# Altium schematic sheet MCU009A_Xds100v2Emu.SchDoc: Xds100v2Emu
size 431 x 279 mm; Date: Not shown in title block; ApprovedBy: Not shown in title block; CheckedBy: Not shown in title block; Author: Not shown in title block; CompanyName: Not shown in title block; Engineer: Not shown in title block; Organization: Not shown in title block; Address1: Not shown in title block; Address2: Not shown in title block; Address3: Not shown in title block; Address4: Not shown in title block; DocumentNumber: 5; Revision: Use project parameter SCH_Rev; SheetNumber: 5; SheetTotal: 7; PageSetup: Record=PageOptions|CenterHorizontal=True|CenterVertical=True|PrintScale=1.00|XCorrection=1.00|YCorrection=1.00|PrintKind=0|BorderSize=5000000|LeftOffset=0|BottomOffset=0|Orientation=2|PaperLength=1000|PaperWidth=1000|Scale=100|PaperSource=15|PrintQuality=600|MediaType=1|DitherType=10|PaperKind=Letter|PrintScaleMode=1; CurrentTime: Not shown in title block; CurrentDate: Not shown in title block; Time: Not shown in title block; DocumentFullPathAndName: Not shown in title block; DocumentName: Not shown in title block; ModifiedDate: Not shown in title block; ImagePath: Not shown in title block
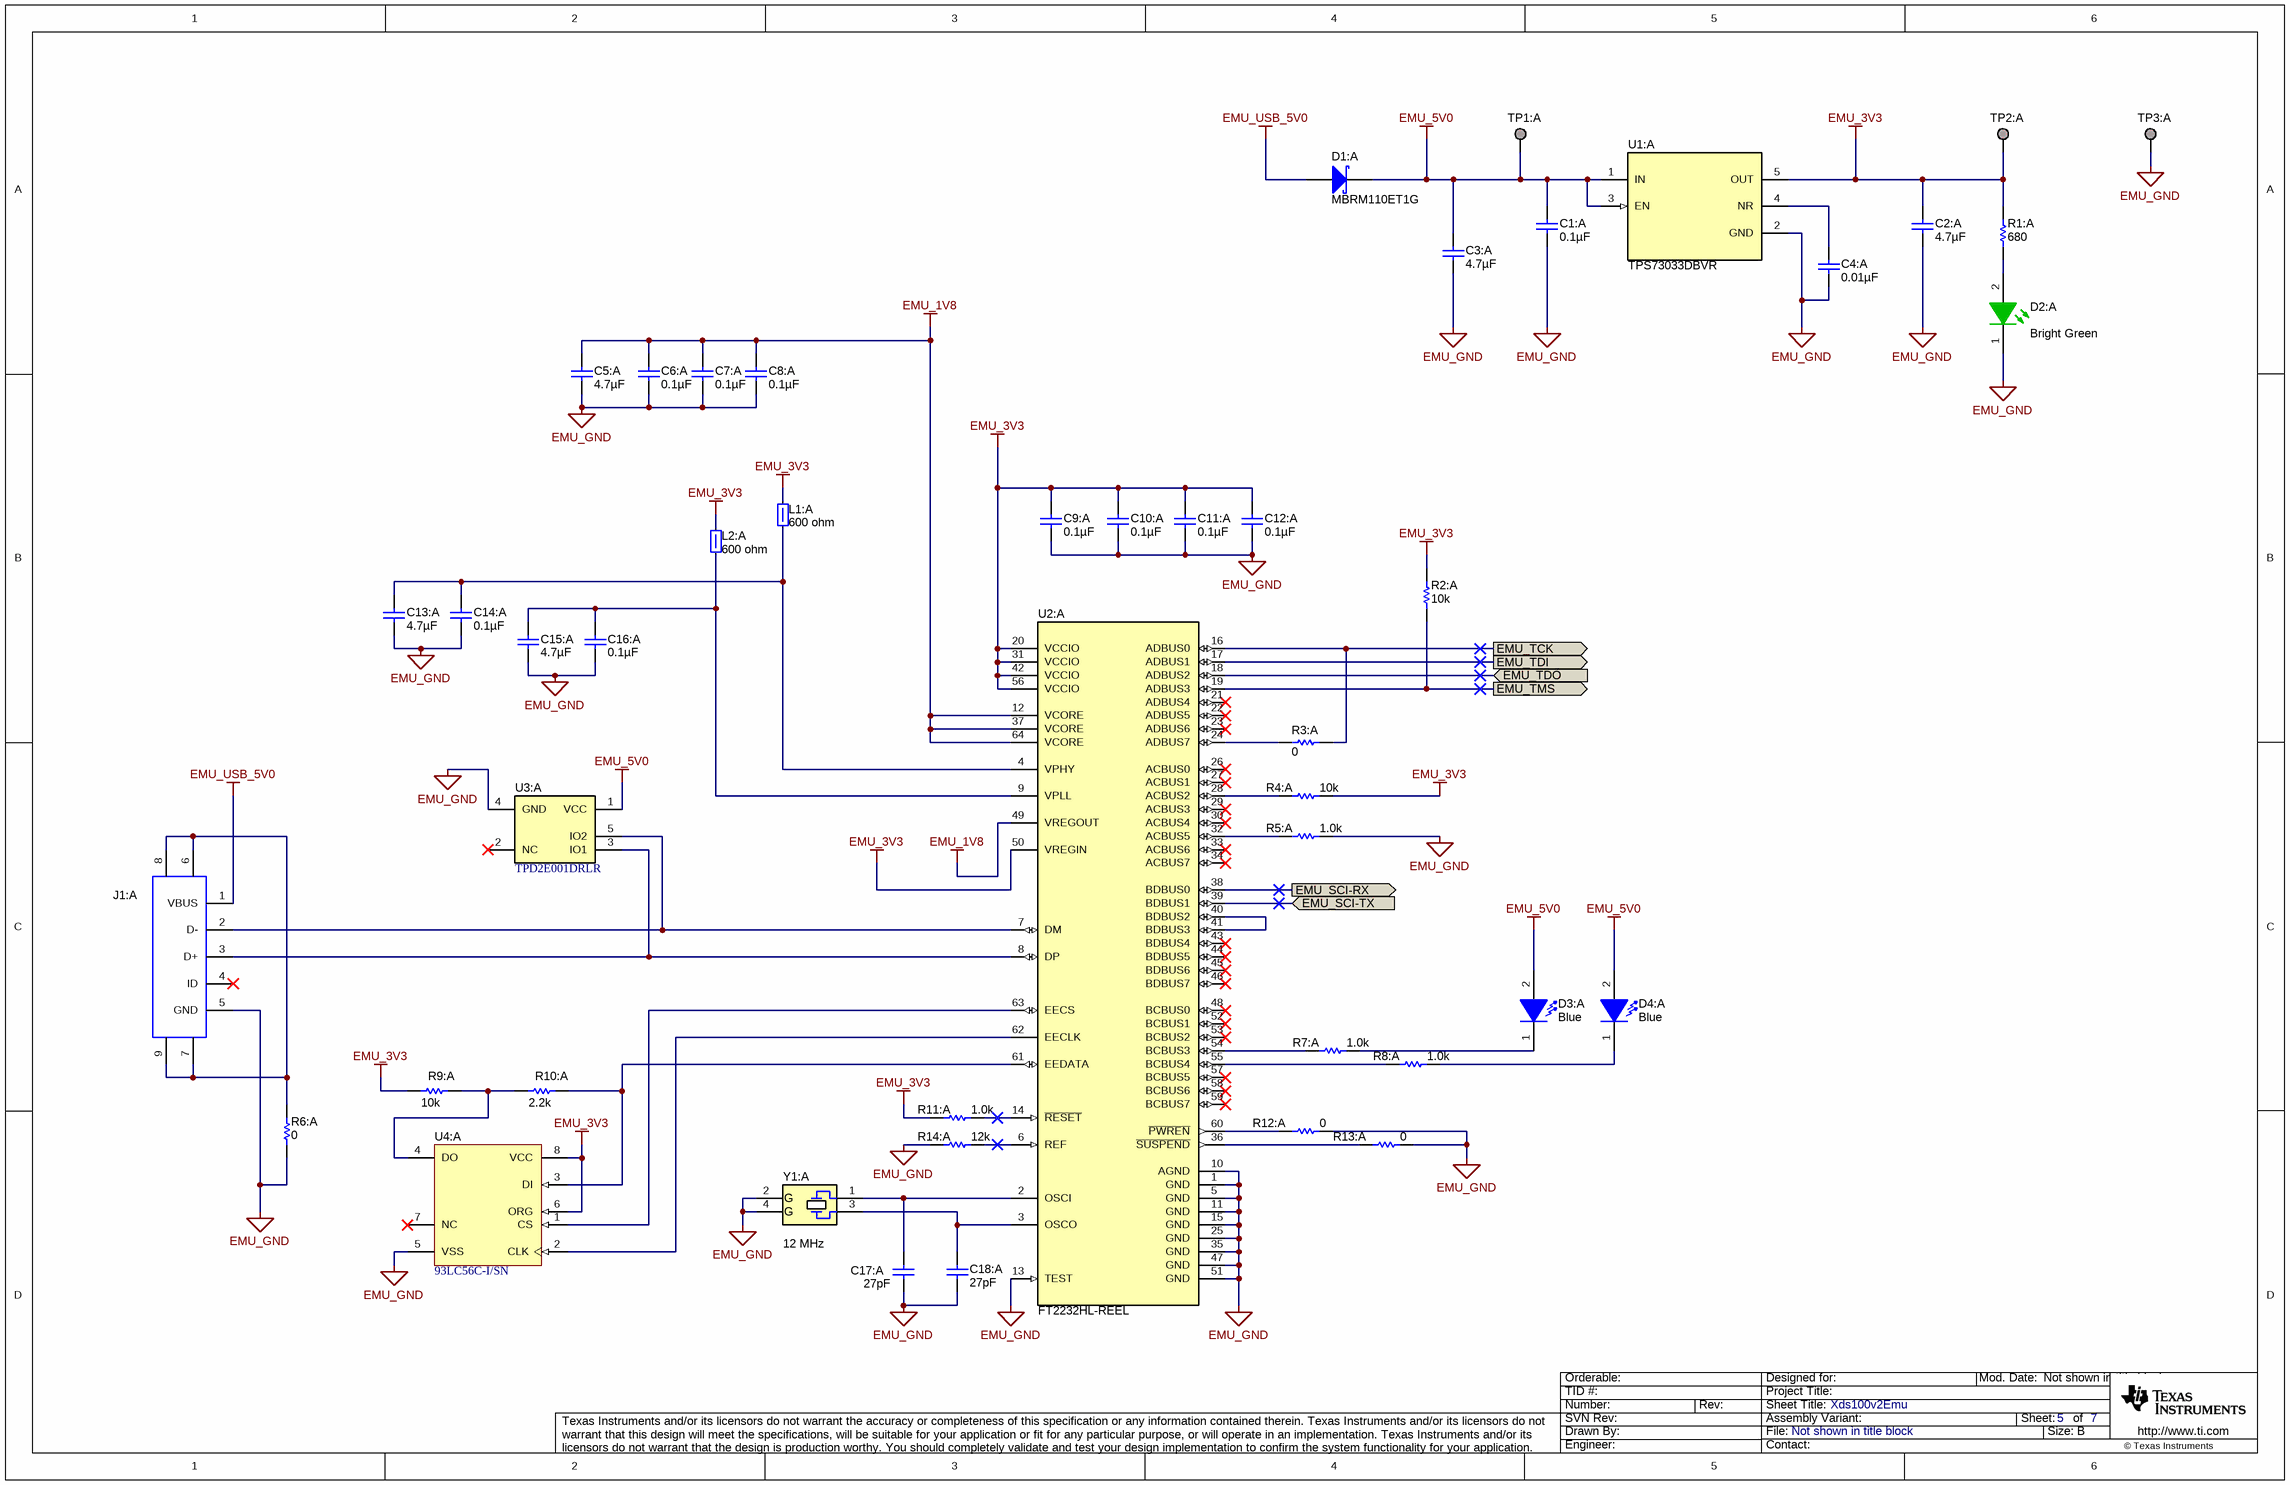
[diagram p0: MCU009A_Xds100v2Emu.SchDoc]

## Parts
C1:A  ValueDisplayed: 0.1µF  [0402]  (hidden comment: GRM155R71A104KA01D)
C2:A  ValueDisplayed: 4.7µF  [0603]  (hidden comment: GRM188R60J475ME19D)
C3:A  ValueDisplayed: 4.7µF  [0603]  (hidden comment: GRM188R60J475ME19D)
C4:A  ValueDisplayed: 0.01µF  [0402]  (hidden comment: GRM155R71C103KA01D)
C5:A  ValueDisplayed: 4.7µF  [0603]  (hidden comment: GRM188R60J475ME19D)
C6:A  ValueDisplayed: 0.1µF  [0402]  (hidden comment: GRM155R71A104KA01D)
C7:A  ValueDisplayed: 0.1µF  [0402]  (hidden comment: GRM155R71A104KA01D)
C8:A  ValueDisplayed: 0.1µF  [0402]  (hidden comment: GRM155R71A104KA01D)
C9:A  ValueDisplayed: 0.1µF  [0402]  (hidden comment: GRM155R71A104KA01D)
C10:A  ValueDisplayed: 0.1µF  [0402]  (hidden comment: GRM155R71A104KA01D)
C11:A  ValueDisplayed: 0.1µF  [0402]  (hidden comment: GRM155R71A104KA01D)
C12:A  ValueDisplayed: 0.1µF  [0402]  (hidden comment: GRM155R71A104KA01D)
C13:A  ValueDisplayed: 4.7µF  [0603]  (hidden comment: GRM188R60J475ME19D)
C14:A  ValueDisplayed: 0.1µF  [0402]  (hidden comment: GRM155R71A104KA01D)
C15:A  ValueDisplayed: 4.7µF  [0603]  (hidden comment: GRM188R60J475ME19D)
C16:A  ValueDisplayed: 0.1µF  [0402]  (hidden comment: GRM155R71A104KA01D)
C17:A  ValueDisplayed: 27pF  [0402]  (hidden comment: GRM1555C1H270JA01D)
C18:A  ValueDisplayed: 27pF  [0402]  (hidden comment: GRM1555C1H270JA01D)
D1:A  MBRM110ET1G  [POWERMITE]
D2:A  value Bright Green  [WL-SMCW_Green_0805]  (hidden comment: 150080VS75000)
D3:A  value Blue  [WL-SMCW_Blue_0805]  (hidden comment: 150080BS75000)
D4:A  value Blue  [WL-SMCW_Blue_0805]  (hidden comment: 150080BS75000)
J1:A  65100516121  [Wurth_65100516121]  (value not drawn)
L1:A  value 600 ohm  [0805_HV]  (hidden comment: HZ0805E601R-10)
L2:A  value 600 ohm  [0805_HV]  (hidden comment: HZ0805E601R-10)
R1:A  ValueDisplayed: 680  [0402]  (hidden comment: CRCW0402680RJNED)
R2:A  ValueDisplayed: 10k  [0402]  (hidden comment: CRCW040210K0JNED)
R3:A  ValueDisplayed: 0  [0402]  (hidden comment: CRCW04020000Z0ED)
R4:A  ValueDisplayed: 10k  [0402]  (hidden comment: CRCW040210K0JNED)
R5:A  ValueDisplayed: 1.0k  [0402]  (hidden comment: CRCW04021K00JNED)
R6:A  ValueDisplayed: 0  [0402]  (hidden comment: CRCW04020000Z0ED)
R7:A  ValueDisplayed: 1.0k  [0402]  (hidden comment: CRCW04021K00JNED)
R8:A  ValueDisplayed: 1.0k  [0402]  (hidden comment: CRCW04021K00JNED)
R9:A  ValueDisplayed: 10k  [0402]  (hidden comment: CRCW040210K0JNED)
R10:A  ValueDisplayed: 2.2k  [0402]  (hidden comment: CRCW04022K20JNED)
R11:A  ValueDisplayed: 1.0k  [0402]  (hidden comment: CRCW04021K00JNED)
R12:A  ValueDisplayed: 0  [0402]  (hidden comment: CRCW04020000Z0ED)
R13:A  ValueDisplayed: 0  [0402]  (hidden comment: CRCW04020000Z0ED)
R14:A  ValueDisplayed: 12k  [0402]  (hidden comment: CRCW040212K0JNED)
TP1:A  TESTPOINT  [TP_50MIL-25MILHOLE]  (value not drawn)  (no BOM)
TP2:A  TESTPOINT  [TP_50MIL-25MILHOLE]  (value not drawn)  (no BOM)
TP3:A  TESTPOINT  [TP_50MIL-25MILHOLE]  (value not drawn)  (no BOM)
U1:A  TPS73033DBVR  [DBV0005A_N]
U2:A  FT2232HL-REEL  [LQFP64_N]
U3:A  TPD2E001DRLR  [DRL0005A]
U4:A  93LC56C-I/SN  [SOIC-8]
Y1:A  Frequency: 12 MHz  [ECS_ECX-53B]  (hidden comment: ECS-120-20-30B-TR)

## Ports
EMU_SCI-RX (out), EMU_SCI-TX (in), EMU_TCK (out), EMU_TDI (out), EMU_TDO (in), EMU_TMS (out)

## Nets
EMU_1V8: C5:A.2 C6:A.2 C7:A.2 C8:A.2 U2:A.12(VCORE) U2:A.37(VCORE) U2:A.49(VREGOUT) U2:A.64(VCORE)
EMU_3V3: C2:A.1 C9:A.2 C10:A.2 C11:A.2 C12:A.2 L1:A.2 L2:A.2 R1:A.1 R2:A.2 R4:A.2 R9:A.1 R11:A.1 TP2:A.1 U1:A.5(OUT) U2:A.20(VCCIO) U2:A.31(VCCIO) U2:A.42(VCCIO) U2:A.50(VREGIN) U2:A.56(VCCIO) U4:A.6(ORG) U4:A.8(VCC)
EMU_5V0: C1:A.2 C3:A.1 D1:A.1(K) D3:A.2(A) D4:A.2(A) TP1:A.1 U1:A.1(IN) U1:A.3(EN) U3:A.1(VCC)
EMU_GND: C1:A.1 C2:A.2 C3:A.2 C4:A.1 C5:A.1 C6:A.1 C7:A.1 C8:A.1 C9:A.1 C10:A.1 C11:A.1 C12:A.1 C13:A.2 C14:A.1 C15:A.2 C16:A.1 C17:A.1 C18:A.1 D2:A.1(K) J1:A.5(GND) R5:A.2 R6:A.2 R12:A.1 R13:A.1 R14:A.1 TP3:A.1 U1:A.2(GND) U2:A.1(GND) U2:A.5(GND) U2:A.10(AGND) U2:A.11(GND) U2:A.13(TEST) U2:A.15(GND) U2:A.25(GND) U2:A.35(GND) U2:A.47(GND) U2:A.51(GND) U3:A.4(GND) U4:A.5(VSS) Y1:A.2(GND) Y1:A.4(GND)
EMU_USB_5V0: D1:A.2(A) J1:A.1(VBUS)
EMU_SCI-RX: U2:A.38(BDBUS0) ; port EMU_SCI-RX
EMU_SCI-TX: U2:A.39(BDBUS1) ; port EMU_SCI-TX
EMU_TCK: R3:A.1 U2:A.16(ADBUS0) ; port EMU_TCK
EMU_TDI: U2:A.17(ADBUS1) ; port EMU_TDI
EMU_TDO: U2:A.18(ADBUS2) ; port EMU_TDO
EMU_TMS: R2:A.1 U2:A.19(ADBUS3) ; port EMU_TMS
NetC4:A_2: C4:A.2 U1:A.4(NR)
NetC13:A_1: C13:A.1 C14:A.2 L1:A.1 U2:A.4(VPHY)
NetC15:A_1: C15:A.1 C16:A.2 L2:A.1 U2:A.9(VPLL)
NetC17:A_2: C17:A.2 U2:A.2(OSCI) Y1:A.1
NetC18:A_2: C18:A.2 U2:A.3(OSCO) Y1:A.3
NetD2:A_2: D2:A.2(A) R1:A.2
NetD3:A_1: D3:A.1(K) R7:A.2
NetD4:A_1: D4:A.1(K) R8:A.2
NetJ1:A_2: J1:A.2(D-) U2:A.7(DM) U3:A.5(IO2)
NetJ1:A_3: J1:A.3(D+) U2:A.8(DP) U3:A.3(IO1)
NetJ1:A_6: J1:A.6 J1:A.7 J1:A.8 J1:A.9 R6:A.1
NetR3:A_2: R3:A.2 U2:A.24(ADBUS7)
NetR4:A_1: R4:A.1 U2:A.28(ACBUS2)
NetR5:A_1: R5:A.1 U2:A.32(ACBUS5)
NetR7:A_1: R7:A.1 U2:A.54(BCBUS3)
NetR8:A_1: R8:A.1 U2:A.55(BCBUS4)
NetR9:A_2: R9:A.2 R10:A.1 U4:A.4(DO)
NetR10:A_2: R10:A.2 U2:A.61(EEDATA) U4:A.3(DI)
NetR11:A_2: R11:A.2 U2:A.14(~{RESET})
NetR12:A_2: R12:A.2 U2:A.60(~{PWREN})
NetR13:A_2: R13:A.2 U2:A.36(~{SUSPEND})
NetR14:A_2: R14:A.2 U2:A.6(REF)
NetU2:A_40: U2:A.40(BDBUS2) U2:A.41(BDBUS3)
NetU2:A_62: U2:A.62(EECLK) U4:A.2(CLK)
NetU2:A_63: U2:A.63(EECS) U4:A.1(CS)

Not connected (* = marked no-connect by the designer): J1:A 4(ID)*; U2:A 21(ADBUS4)* 22(ADBUS5)* 23(ADBUS6)* 26(ACBUS0)* 27(ACBUS1)* 29(ACBUS3)* 30(ACBUS4)* 33(ACBUS6)* 34(ACBUS7)* 43(BDBUS4)* 44(BDBUS5)* 45(BDBUS6)* 46(BDBUS7)* 48(BCBUS0)* 52(BCBUS1)* 53(BCBUS2)* 57(BCBUS5)* 58(BCBUS6)* 59(BCBUS7)*; U3:A 2(NC)*; U4:A 7(NC)*

## Notes on the sheet
- Drawn By:
- SVN Rev:
- Number:
- TID #:
- Orderable:
- Rev:
- Sheet Title:
- File:
- Project Title:
- Designed for:
- Assembly Variant:
- Mod. Date:
- Sheet:
- Size:
- of
- B
- http://www.ti.com
- Texas Instruments and/or its licensors do not warrant the accuracy or completeness of this specification or any information contained therein. Texas Instruments and/or its licensors do not warrant that this design will meet the specifications, will be suitable for your application or fit for any particular purpose, or will operate in an implementation. Texas Instruments and/or its licensors do not warrant that the design is production worthy. You should completely validate and test your design implementation to confirm the system functionality for your application.
- Engineer:
- Contact:
- © Texas Instruments
- (in symbol ECS-120-20-30B-TR) G

## Library data of the parts
C1:A C6:A C7:A C8:A C9:A C10:A C11:A C12:A C14:A C16:A = GRM155R71A104KA01D: CAP, CERM, 0.1 µF, 10 V, +/- 10%, X7R, 0402; Manufacturer: MuRata; Polarized: N; CompType: Capacitor; Value: 0.1uF; U/M: EA; Cap_F: 0.0000001; Tolerance_%: 10; Value1: Unknown; Value2: 10V; TaMin_C: -55; TaMax_C: 125; AEC Category: Q200; SizeArea_mm2: 0.5; SizeAreaWB_mm2: 3; SizeX_mm: 1; SizeZ_mm: 0.6; SymbolVersion: 2008-07-09; PartNumber: GRM155R71A104KA01D; PackageReference: 0402; RoHS: Y; VDC_V: 10; MountType: SMT; Technology: Ceramic; TempCo: X7R; Cap_Case: 0402; Published: 2008-06-19; Publisher: Texas Instruments; LatestRevisionDate: 2016-10-03; ComponentLink1Description: Datasheet link; ComponentLink1URL: http://search.murata.co.jp/Ceramy/PnsearchViewAction.do?HnOFG=ON&HnNFG=ON&SEL_CNT=50&sLang=en&sKey=GRM155R71A104KA01D&x=9&y=9&search=startwith; Supplier 1: Digi-Key; Supplier Part Number 1: GRM155R71A104KA01D-ND; Supplier 2: Mouser; Supplier Part Number 2: 81-GRM155R71A104KA1D; Supplier 3: Farnell; Supplier Part Number 3: 1828860; AEC Qualified: ?; SizeY_mm: 0.5
C2:A C3:A C5:A C13:A C15:A = GRM188R60J475ME19D: CAP, CERM, 4.7 µF, 6.3 V, +/- 20%, X5R, 0603; Manufacturer: MuRata; Polarized: N; CompType: Capacitor; Value: 4.7uF; U/M: EA; Cap_F: 0.0000047; Tolerance_%: 20; ESR_ohm: 0.001; Value1: 0.001 ohm; VDC_V: 6.3; Value2: 6.3V; TaMin_C: -55; TaMax_C: 85; AEC Category: Q200; SizeArea_mm2: 1.28; SizeAreaWB_mm2: 4.68; SizeX_mm: 1.6; SizeY_mm: 0.8; SizeZ_mm: 1; SymbolVersion: 2008-07-09; PartNumber: GRM188R60J475ME19D; PackageReference: 0603; RoHS: Y; MountType: SMT; Technology: Ceramic; TempCo: X5R; Cap_Case: 0603; Published: 2008-06-19; Publisher: Texas Instruments; LatestRevisionDate: 2016-10-03; ComponentLink1Description: Datasheet link; ComponentLink1URL: http://search.murata.co.jp/Ceramy/image/img/PDF/ENG/GRM188R60J475ME19.pdf; Supplier 1: Digi-Key; Supplier Part Number 1: 490-5421-1-ND; Supplier 2: Mouser; Supplier Part Number 2: 81-GRM188R60J475ME9D; AEC Qualified: ?
C4:A = GRM155R71C103KA01D: CAP, CERM, 0.01 µF, 16 V, +/- 10%, X7R, 0402; Manufacturer: MuRata; Polarized: N; CompType: Capacitor; Value: 0.01uF; U/M: EA; Cap_F: 0.00000001; Tolerance_%: 10; Value1: Unknown; VDC_V: 16; Value2: 16V; TaMin_C: -55; TaMax_C: 125; AEC Category: Q200; SizeArea_mm2: 0.5; SizeAreaWB_mm2: 3; SizeX_mm: 1; SizeZ_mm: 0.6; SymbolVersion: 2008-07-09; PartNumber: GRM155R71C103KA01D; PackageReference: 0402; RoHS: Y; MountType: SMT; Technology: Ceramic; TempCo: X7R; Cap_Case: 0402; Published: 2008-06-19; Publisher: Texas Instruments; LatestRevisionDate: 2016-10-03; ComponentLink1Description: Datasheet link; ComponentLink1URL: http://search.murata.co.jp/Ceramy/PnsearchViewAction.do?HnOFG=ON&HnNFG=ON&SEL_CNT=50&sLang=en&sKey=GRM155R71C103KA01D&x=9&y=9&search=startwith; Supplier 1: Digi-Key; Supplier Part Number 1: 490-1313-1-ND; Supplier 2: Mouser; Supplier Part Number 2: 81-GRM36X103K16; Supplier 3: Farnell; Supplier Part Number 3: 1828864; AEC Qualified: ?; SizeY_mm: 0.5
C17:A C18:A = GRM1555C1H270JA01D: CAP, CERM, 27 pF, 50 V, +/- 5%, C0G/NP0, 0402; Manufacturer: MuRata; Polarized: N; CompType: Capacitor; Value: 27pF; U/M: EA; Cap_F: 0.000000000027; Tolerance_%: 5; Value1: Unknown; VDC_V: 50; Value2: 50V; TaMin_C: -55; TaMax_C: 125; AEC Category: Q200; SizeArea_mm2: 0.5; SizeAreaWB_mm2: 3; SizeX_mm: 1; SizeZ_mm: 0.6; SymbolVersion: 2008-07-09; PartNumber: GRM1555C1H270JA01D; PackageReference: 0402; RoHS: Y; MountType: SMT; Technology: Ceramic; TempCo: C0G/NP0; Cap_Case: 0402; Published: 2008-06-19; Publisher: Texas Instruments; LatestRevisionDate: 2016-10-03; ComponentLink1Description: Datasheet link; ComponentLink1URL: http://search.murata.co.jp/Ceramy/PnsearchViewAction.do?HnOFG=ON&HnNFG=ON&SEL_CNT=50&sLang=en&sKey=GRM1555C1H270JA01D&x=9&y=9&search=startwith; Supplier 1: Mouser; Supplier Part Number 1: 81-GRM1555C1H270JA1D; Supplier 2: Farnell; Supplier Part Number 2: 1828877; Supplier 3: Newark; Supplier Part Number 3: 14T3294; AEC Qualified: ?; SizeY_mm: 0.5
D1:A = MBRM110ET1G: Diode, Schottky, 10 V, 1 A, AEC-Q101, POWERMITE; Manufacturer: ON Semiconductor; U/M: EA; Vf_V: 0.53; Value: 10V; Value1: 1A; Value2: 0.53V; Io_A: 1; Vr_V: 10; TJmax_C: 150; AEC Category: Q101; AEC Qualified: Y; SizeAreaWB_mm2: 14.945; SizeArea_mm2: 7.995; SizeX_mm: 3.9; SizeY_mm: 2.05; SizeZ_mm: 1.15; CompType: Diode; SymbolVersion: 2008-12-08; PartNumber: MBRM110ET1G; PackageReference: POWERMITE; MountType: SMT; Type: Schottky; RoHS: Y; Published: 2008-06-26; Publisher: Texas Instruments; LatestRevisionDate: 2016-09-30; ComponentLink1Description: Datasheet link; ComponentLink1URL: http://www.onsemi.com/pub_link/Collateral/MBRM110E-D.PDF; Supplier 1: Digi-Key; Supplier Part Number 1: MBRM110ET1GOSCT-ND; Supplier 2: Mouser; Supplier Part Number 2: 863-MBRM110ET1G; Supplier 3: Farnell; Supplier Part Number 3: 2369429
D2:A = 150080VS75000: LED, Bright Green, SMD; Manufacturer: Wurth Elektronik; SymbolCreator: Altium; Type: AlInGaP; Vf_V: 2; Value2: 2V; Io_A: 0.02; Vr_V: 5; Tjmax_C: 85; Power_TotalModule: 0.072; Value1: 0.072W; Angle: 140; U/M: EA; SymbolVersion: 2015-01-20; PartNumber: 150080VS75000; PackageReference: LED_0805; RoHS: Y; CompType: LED; MountType: SMT; Color: Bright Green; Published: 2008-07-11; Publisher: Texas Instruments; ComponentLink1URL: http://katalog.we-online.de/led/datasheet/150080VS75000.pdf; ComponentLink1Description: Datasheet link; LatestRevisionDate: 2016-09-30; Supplier 1: Digi-Key; Supplier Part Number 1: 732-4986-1-ND; Supplier 2: Mouser; Supplier Part Number 2: 710-150080VS75000; Supplier 3: Farnell; Supplier Part Number 3: 2322081
D3:A D4:A = 150080BS75000: LED, Blue, SMD; Manufacturer: Wurth Elektronik; Type: InGaN; Vf_V: 3.2; Value2: 3.2V; Io_A: 0.02; Vr_V: 5; Tjmax_C: 85; Power_TotalModule: 0.105; Value1: 0.105W; Angle: 140; U/M: EA; CompType: LED; PartNumber: 150080BS75000; SymbolVersion: 2008-11-06; MountType: SMT; RoHS: Y; PackageReference: LED_0805; Color: Blue; Published: 2008-07-11; Publisher: Texas Instruments; ComponentLink1URL: http://katalog.we-online.de/led/datasheet/150080BS75000.pdf; ComponentLink1Description: Datasheet link; LatestRevisionDate: 2016-09-30; Supplier 1: Digi-Key; Supplier Part Number 1: 732-4982-1-ND; Supplier 2: Mouser; Supplier Part Number 2: 710-150080BS75000; Supplier 3: Farnell; Supplier Part Number 3: 2322075
J1:A = 65100516121: Connector, Receptacle, USB Mini B 2.0, SMT; Manufacturer: Wurth Elektronik; SymbolCreator: a0799628; Pitch_mm: 0.8; Gender: Female; Row_Count: 1; ContactFinish: Gold; Voltage_V: 30; Cert_UL: Y; SymbolVersion: 2013-05-02; PartNumber: 65100516121; PackageReference: Connector, Receptacle, USB Mini B 2.0, 5 Position, SMT; CompType: Connector; RoHS: Y; MountType: SMT; ComponentLink1Description: Datasheet URL; ComponentLink1URL: http://katalog.we-online.de/em/datasheet/65100516121.pdf; Publisher: Texas Instruments; LatestRevisionDate: 2016-10-04; Supplier 1: Digi-Key; Supplier Part Number 1: 732-2109-1-ND; Supplier 2: Mouser; Supplier Part Number 2: 710-65100516121; Supplier 3: Farnell; Supplier Part Number 3: 1642036; Orientation: R/A; PinCount: 5; Color: Black; Current_A: 1; Cert_CULUS: Y
L1:A L2:A = HZ0805E601R-10: Ferrite Bead, 600 ohm @ 100 MHz, 0.5 A, 0805; Manufacturer: Laird-Signal Integrity Products; Imax_A: 0.5; DCR_ohm: 0.3; Value1: 0.3 ohm; Value2: 0.5A; ZTyp@100MHz_Ohm: 600; CompType: Ferrite Bead; SymbolVersion: 2009-06-02; PartNumber: HZ0805E601R-10; MountType: SMT; PackageReference: 0805; Published: 2014-04-30; Publisher: Texas Instruments; LatestRevisionDate: 2016-10-02; ComponentLink1Description: Datasheet link; ComponentLink1URL: http://www.lairdtech.com/WorkArea/linkit.aspx?linkIdentifier=id&ItemID=4884; RoHS: Y; Supplier 1: Digi-Key; Supplier Part Number 1: 240-2399-1-ND; Supplier 2: Mouser; Supplier Part Number 2: 875-HZ0805E601R-10; Supplier 3: Farnell; Supplier Part Number 3: 2292412
R1:A = CRCW0402680RJNED: RES, 680, 5%, 0.063 W, 0402; Manufacturer: Vishay-Dale; CompType: Resistor; Value: 680; Value_Code: 680R; Tolerance_%: 5; Power_W: 0.063; Value2: 0.063W; VDC_V: 50; TempCo: 200 ppm/C; EIA_Code: E24; U/M: EA; AEC Category: Q200; SizeArea_mm2: 0.5; SizeX_mm: 1; SizeZ_mm: 0.6; SymbolVersion: 2009-05-29; PartNumber: CRCW0402680RJNED; PackageReference: 0402; RoHS: Y; Res_ohm: 680; Value1: 5%; MountType: SMT; Technology: Thick Film; Published: 2008-06-26; Publisher: Texas Instruments; LatestRevisionDate: 2016-10-03; ComponentLink1Description: Datasheet link; ComponentLink1URL: http://www.vishay.com/docs/20035/dcrcwe3.pdf; Supplier 1: Digi-Key; Supplier Part Number 1: 541-680JCT-ND; Supplier 2: Mouser; Supplier Part Number 2: 71-CRCW0402J-680-E3; Supplier 3: Farnell; Supplier Part Number 3: 1537434; AEC Qualified: ?; SizeY_mm: 0.5
R2:A R4:A R9:A = CRCW040210K0JNED: RES, 10 k, 5%, 0.063 W, 0402; Manufacturer: Vishay-Dale; CompType: Resistor; Value: 10k; Res_ohm: 10000; Value_Code: 10k0; Tolerance_%: 5; Power_W: 0.063; Value2: 0.063W; VDC_V: 50; TempCo: 200 ppm/C; EIA_Code: E24; U/M: EA; AEC Category: Q200; SizeArea_mm2: 0.5; SizeX_mm: 1; SizeZ_mm: 0.6; SymbolVersion: 2009-05-29; PartNumber: CRCW040210K0JNED; PackageReference: 0402; RoHS: Y; Value1: 5%; MountType: SMT; Technology: Thick Film; Published: 2008-06-26; Publisher: Texas Instruments; LatestRevisionDate: 2016-10-03; ComponentLink1Description: Datasheet link; ComponentLink1URL: http://www.vishay.com/docs/20035/dcrcwe3.pdf; Supplier 1: Digi-Key; Supplier Part Number 1: 541-10KJCT-ND; Supplier 2: Mouser; Supplier Part Number 2: 71-CRCW0402J-10K-E3; Supplier 3: Farnell; Supplier Part Number 3: 1514663; AEC Qualified: ?; SizeY_mm: 0.5
R3:A R6:A R12:A R13:A = CRCW04020000Z0ED: RES, 0, 5%, 0.063 W, 0402; Manufacturer: Vishay-Dale; CompType: Resistor; Value: 0; Value_Code: 0000; Tolerance_%: 5; Power_W: 0.063; Value2: 0.063W; VDC_V: 50; TempCo: 200 ppm/C; EIA_Code: E24; U/M: EA; AEC Category: Q200; SizeArea_mm2: 0.5; SizeX_mm: 1; SizeZ_mm: 0.6; SymbolVersion: 2009-05-29; PartNumber: CRCW04020000Z0ED; PackageReference: 0402; RoHS: Y; Res_ohm: 0; Value1: 5%; MountType: SMT; Technology: Thick Film; Published: 2008-06-26; Publisher: Texas Instruments; LatestRevisionDate: 2016-10-03; ComponentLink1Description: Datasheet link; ComponentLink1URL: http://www.vishay.com/docs/20035/dcrcwe3.pdf; Supplier 1: Digi-Key; Supplier Part Number 1: 541-0.0JCT-ND; Supplier 2: Mouser; Supplier Part Number 2: 71-CRCW0402-0-E3; Supplier 3: Farnell; Supplier Part Number 3: 1469661; AEC Qualified: ?; SizeY_mm: 0.5
R5:A R7:A R8:A R11:A = CRCW04021K00JNED: RES, 1.0 k, 5%, 0.063 W, 0402; Manufacturer: Vishay-Dale; CompType: Resistor; Value: 1.0k; Res_ohm: 1000; Value_Code: 1k00; Tolerance_%: 5; Power_W: 0.063; Value2: 0.063W; VDC_V: 50; TempCo: 200 ppm/C; EIA_Code: E24; U/M: EA; AEC Category: Q200; SizeArea_mm2: 0.5; SizeX_mm: 1; SizeZ_mm: 0.6; SymbolVersion: 2009-05-29; PartNumber: CRCW04021K00JNED; PackageReference: 0402; RoHS: Y; Value1: 5%; MountType: SMT; Technology: Thick Film; Published: 2008-06-26; Publisher: Texas Instruments; LatestRevisionDate: 2016-10-03; ComponentLink1Description: Datasheet link; ComponentLink1URL: http://www.vishay.com/docs/20035/dcrcwe3.pdf; Supplier 1: Digi-Key; Supplier Part Number 1: 541-1.0KJCT-ND; Supplier 2: Mouser; Supplier Part Number 2: 71-CRCW0402J-1.0K-E3; Supplier 3: Farnell; Supplier Part Number 3: 1514656; AEC Qualified: ?; SizeY_mm: 0.5
R10:A = CRCW04022K20JNED: RES, 2.2 k, 5%, 0.063 W, 0402; Manufacturer: Vishay-Dale; CompType: Resistor; Value: 2.2k; Res_ohm: 2200; Value_Code: 2k20; Tolerance_%: 5; Power_W: 0.063; Value2: 0.063W; VDC_V: 50; TempCo: 200 ppm/C; EIA_Code: E24; U/M: EA; AEC Category: Q200; SizeArea_mm2: 0.5; SizeX_mm: 1; SizeZ_mm: 0.6; SymbolVersion: 2009-05-29; PartNumber: CRCW04022K20JNED; PackageReference: 0402; RoHS: Y; Value1: 5%; MountType: SMT; Technology: Thick Film; Published: 2008-06-26; Publisher: Texas Instruments; LatestRevisionDate: 2016-10-03; ComponentLink1Description: Datasheet link; ComponentLink1URL: http://www.vishay.com/docs/20035/dcrcwe3.pdf; Supplier 1: Digi-Key; Supplier Part Number 1: 541-2.2KJCT-ND; Supplier 2: Mouser; Supplier Part Number 2: 71-CRCW0402J-2.2K-E3; Supplier 3: Farnell; Supplier Part Number 3: 1514678; AEC Qualified: ?; SizeY_mm: 0.5
R14:A = CRCW040212K0JNED: RES, 12 k, 5%, 0.063 W, 0402; Manufacturer: Vishay-Dale; CompType: Resistor; Value: 12k; Res_ohm: 12000; Value_Code: 12k0; Tolerance_%: 5; Power_W: 0.063; Value2: 0.063W; VDC_V: 50; TempCo: 200 ppm/C; EIA_Code: E24; U/M: EA; AEC Category: Q200; SizeArea_mm2: 0.5; SizeX_mm: 1; SizeZ_mm: 0.6; SymbolVersion: 2009-05-29; PartNumber: CRCW040212K0JNED; PackageReference: 0402; RoHS: Y; Value1: 5%; MountType: SMT; Technology: Thick Film; Published: 2008-06-26; Publisher: Texas Instruments; LatestRevisionDate: 2016-10-03; ComponentLink1Description: Datasheet link; ComponentLink1URL: http://www.vishay.com/docs/20035/dcrcwe3.pdf; Supplier 1: Digi-Key; Supplier Part Number 1: 541-12KJCT-ND; Supplier 2: Mouser; Supplier Part Number 2: 71-CRCW040212K0JNED; AEC Qualified: ?; SizeY_mm: 0.5
TP1:A TP2:A TP3:A = TESTPOINT: TEST POINT.  No entry in BOM.; SymbolVersion: 2010-10-20; CompType: Testpoint; PackageReference: N/A; Publisher: Texas Instruments; LatestRevisionDate: 2016-08-23; LatestRevisionNote: Added Alternate PartNumber and Alternate Manufacturer parameters to appropriate components.
U1:A = TPS73033DBVR: Low-Noise, High PSRR, RF, 200-mA Low-Dropout Linear Regulator, DBV0005A (SOT-5); Alternate PartNumber: TPS73033DBVT; Manufacturer: Texas Instruments; SymbolCreator: a0411947; CompType: IC; U/M: EA; SizeArea_mm2: 8.12; SizeAreaWB_mm2: 14.82; SizeX_mm: 2.8; SizeY_mm: 2.9; SizeZ_mm: 1.45; SymbolVersion: 2015-08-14; PartNumber: TPS73033DBVR; PackageReference: DBV0005A; MountType: SMT; ComponentLink1Description: Datasheet Link; ComponentLink1URL: http://www.ti.com/lit/ds/symlink/tps730.pdf; RoHS: Y; Publisher: Texas Instruments; LatestRevisionDate: 2016-10-04; Alternate Manufacturer: Texas Instruments; PackageDescription: SOT-5
U2:A = FT2232HL-REEL: Dual High Speed USB To Multipurpose UART/FIFO IC, LQFP-64; Manufacturer: FTDI; SymbolCreator: Altium; SymbolVersion: 2016-2-18; PartNumber: FT2232HL-REEL; MountType: SMT; ComponentLink1Description: Datasheet URL; ComponentLink1URL: http://www.ftdichip.com/Support/Documents/DataSheets/ICs/DS_FT2232H.pdf; RoHS: Y; PackageReference: LQFP_10x10mm; Publisher: Texas Instruments; LatestRevisionDate: 2016-10-03; Supplier 1: Digi-Key; Supplier Part Number 1: 768-1024-1-ND; Supplier 2: Mouser; Supplier Part Number 2: 895-FT2232HL
U3:A = TPD2E001DRLR: Low-Capacitance + / - 15 kV ESD-Protection Array for High-Speed Data Interfaces, 2 Channels, -40 to +85 degC, 5-pin SOT (DRL), Green (RoHS & no Sb/Br); Manufacturer: Texas Instruments; Alternate PartNumber: Equivalent; Breakdown Voltage(Min)(V): 11; IEC 61000-4-2 Air-Gap(+/- kV): 15; IEC 61000-4-2 Contact(+/- kV): 8; IO Capacitance(Typ)(pF): 1.5; IO Leakage Current(nA): 1; SubFamily: ESD Solution; USB High Speed: TRUE; DatasheetVersion: SLLS684F; PackageVersion: revD, Aug-2007; PackageReference: DRL0005A; PackageDescription: 5-Pin Plastic Small Outline, Flat Lead 0.5 mm Pitch; Supplier 1: Digi-Key; Supplier Part Number 1: 296-21883-2-ND; Supplier 2: Digi-Key; Supplier Part Number 2: 296-21883-1-ND; Supplier 3: Digi-Key; Supplier Part Number 3: 296-21883-6-ND; Supplier 4: Farnell; Supplier Part Number 4: 1412055; Supplier 5: Newark; Supplier Part Number 5: 41M5840; Supplier 6: Mouser; Supplier Part Number 6: 595-TPD2E001DRLR; Eco-Plan: Green (RoHS & no Sb/Br); MountType: SMT; PartNumber: TPD2E001DRLR; ComponentLink1Description: Datasheet; ComponentLink1URL: http://www.ti.com/general/docs/lit/getliterature.tsp?genericPartNumber=TPD2E001&fileType=pdf; ComponentLink2Description: URL Link1; ComponentLink2URL: SamplesURL:http://www.ti.com/product/tpd2e001#samples; Alternate Manufacturer: Texas Instruments
U4:A = 93LC56C-I/SN: 2K Microwire Compatible Serial EEPROM, SOIC-8; Manufacturer: Microchip; SymbolCreator: a0411947; SizeAreaWB_mm2: 55.131; SizeArea_mm2: 29.351; SizeX_mm: 5.99; SizeY_mm: 4.9; SizeZ_mm: 1.75; SymbolVersion: 2015-06-05; PartNumber: 93LC56C-I/SN; MountType: SMT; ComponentLink1Description: Datasheet URL; ComponentLink1URL: http://ww1.microchip.com/downloads/en/DeviceDoc/21794G.pdf; RoHS: Y; PackageReference: SOIC-8; Publisher: Texas Instruments; LatestRevisionDate: 2016-10-03; Supplier 1: Digi-Key; Supplier Part Number 1: 93LC56C-I/SN-ND; Supplier 2: Mouser; Supplier Part Number 2: 579-93LC56C-I/SNG; Supplier 3: Farnell; Supplier Part Number 3: 1556166
Y1:A = ECS-120-20-30B-TR: Crystal, 12MHz, 20pF, SMD; Manufacturer: ECS Inc.; SymbolCreator: a0411947; U/M: EA; TaMin_C: -20; TaMax_C: 70; Frequency Stability: ±50ppm; SymbolVersion: 2016-1-22; PartNumber: ECS-120-20-30B-TR; CompType: Crystal; PackageReference: 5x3.2mm; MountType: SMT; RoHS: Y; ComponentLink1Description: Datasheet Link; ComponentLink1URL: http://www.ecsxtal.com/store/pdf/ecx_53b.pdf; Publisher: Texas Instruments; LatestRevisionDate: 2016-09-19; Supplier 1: Digi-Key; Supplier Part Number 1: XC1118CT-ND; Supplier 2: Mouser; Supplier Part Number 2: 520-ECS-120-20-30B